# EasyEDA Pro project ProPrj_初级项目_2026-01-11.epro, schematic Schematic1_1
Board Name: Board1_1; Create Date: 2025-11-14; Page Name: P1; Project Name: 初级项目; Schematic Name: Schematic1_1; Update Date: 2025-12-01; Company: 嘉立创EDA; Page Size: A4; Version: V1.0
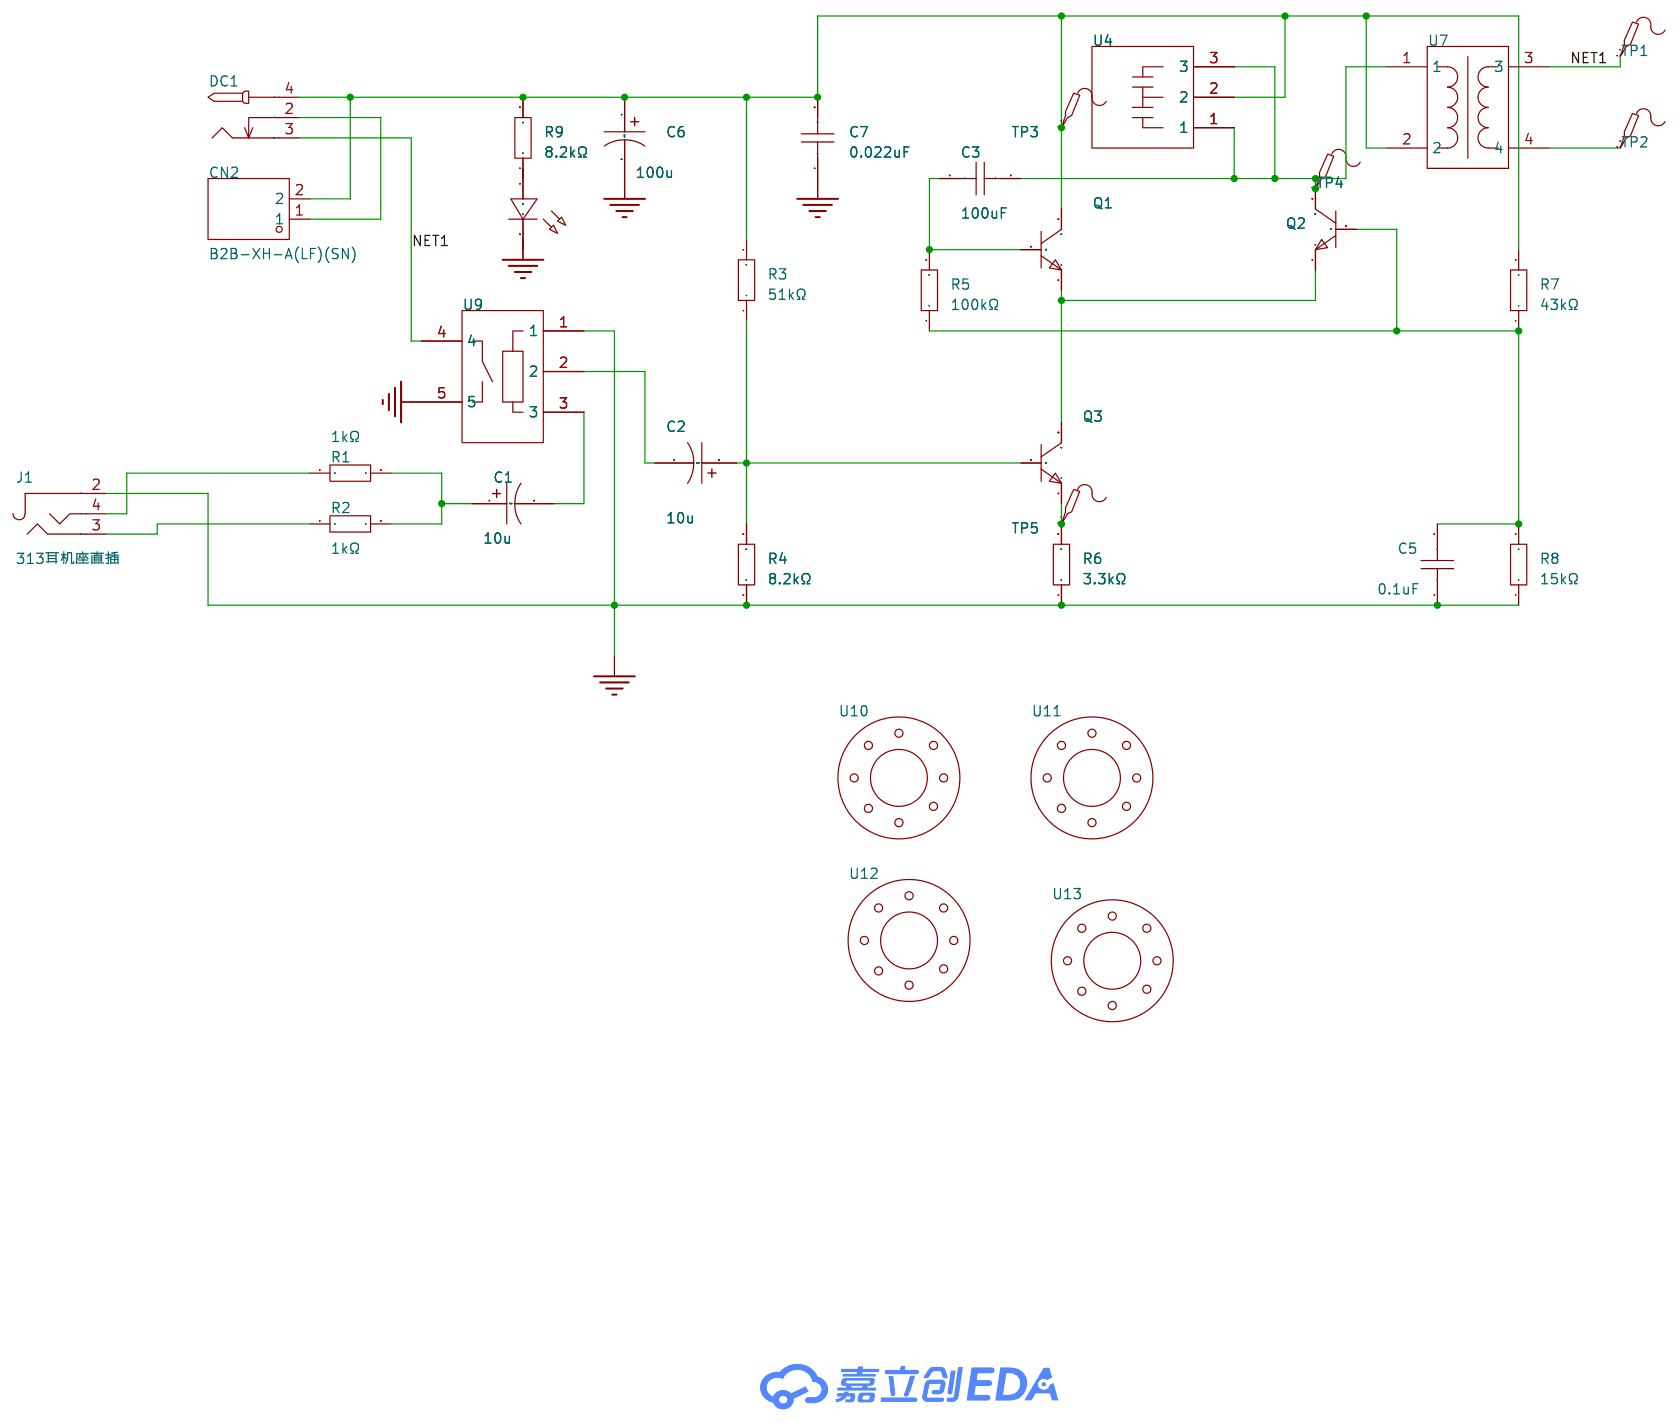
[diagram p2: schematic sheet]

## Parts
C1  10u  [CAP-TH_BD10.0-P5.00-D0.6-FD]
C2  10u  [CAP-TH_BD10.0-P5.00-D0.6-FD]
C3  100uF  [CAP-TH_L5.5-W3.8-P5.08-D0.5]
C5  0.1uF  [CAP-TH_L5.5-W3.8-P5.08-D0.5]
C6  100u  [CAP-TH_BD10.0-P5.00-D0.6-FD]
C7  0.022uF  [CAP-TH_L5.5-W3.8-P5.08-D0.5]
CN2  B2B-XH-A(LF)(SN)  [CONN-TH_B2B-XH-A-LF-SN]
DC1  -  [DC-2.0]
J1  313耳机座直插  [AUDIO-TH_PJ313D]
LED2  -  [LED-TH_5mm]
Q1  S9018H331  [TO-92-3_L4.8-W3.7-P1.27-L-1]
Q2  S9018H331  [TO-92-3_L4.8-W3.7-P1.27-L-1]
Q3  S9018H331  [TO-92-3_L4.8-W3.7-P1.27-L-1]
R1  1kΩ  [Res_1/8W]
R2  1kΩ  [Res_1/8W]
R3  51kΩ  [Res_1/8W]
R4  8.2kΩ  [Res_1/8W]
R5  100kΩ  [Res_1/8W]
R6  3.3kΩ  [Res_1/8W]
R7  43kΩ  [Res_1/8W]
R8  15kΩ  [Res_1/8W]
R9  8.2kΩ  [Res_1/8W]
TP1  -  [Test-Point-0.5mm]
TP2  -  [Test-Point-0.5mm]
TP3  -  [Test-Point-0.5mm]
TP4  -  [Test-Point-0.5mm]
TP5  -  [Test-Point-0.5mm]
U4  -  [可变电容]
U7  -  [天线变压器]
U9  -  [发射机点位图]
U10  -  [固定孔]
U11  -  [固定孔]
U12  -  [固定孔]
U13  -  [固定孔]

## Library data of the parts
C1 C2 C6 = LF221M1HBKJ1013VGN: Supplier Part: C9900022454; Supplier Footprint: 直插电解电容（高频）,220uF±20%,50V,Pitch=5mm,φ10mm,H13mm,剪脚，脚长3.6mm，佳维诚; JLCPCB Part Class: 扩展库; Supplier: LCSC
C3 C5 C7 = CT4-1206B225K250PF3: 容值:2.2uF;精度:±10%;额定电压:25V;温度系数:X7R;; LCSC Part Name: 2.2uF ±10% 25V; Supplier Part: C723346; Manufacturer: FH(风华); Supplier Footprint: 插件,P=5.08mm; JLCPCB Part Class: 扩展库; Datasheet: https://item.szlcsc.com/datasheet/CT4-1206B225K250PF3/768037.html; Supplier: LCSC; Tolerance: ±10%; Voltage Rating: 25V; Temperature Coefficient: X7R; Pin Spacing: 5.08mm
CN2 = B2B-XH-A(LF)(SN): 插针结构:1x2P;间距:2.5mm;安装方式:直插;参考系列:XH;总PIN数:2P;排数:1;每排PIN数:2;行距:-;额定电流:3A;触头材质:黄铜;触头镀层:锡;工作温度:-25℃~+85℃;; LCSC Part Name: 1x2P 间距:2.5mm 直插 系列:XH; Supplier Part: C158012; Manufacturer: JST; Supplier Footprint: 插件,P=2.5mm; JLCPCB Part Class: 扩展库; Datasheet: https://item.szlcsc.com/datasheet/B2B-XH-A(LF)(SN)/169360.html; Supplier: LCSC; Pins Structure: 1x2P; Pitch: 2.5mm; Mounting Type: 直插; Reference Series: XH; Number of Pins: 2P; Number of Rows: 1; Number of PINs Per Row: 2; Current Rating: 3A; Contact Material: 黄铜; Contact Plating: 锡; Operating Temperature: -25℃~+85℃; Voltage Rating: 250V; Plastic Material: PA66; Flame Retardant Rating: UL94V-0; Supplementary Features: 打K脚; Color: 白色; Z-Height of the Board: 7mm; X-Length of Bottom Edge on Board (Spacing Line): 7.4mm; Y-Width of Bottom Edge on Board: 5.75mm
DC1 = DC-005_2.0: Supplier Footprint: 插件
J1 = 313耳机座直插: 连接器类型:3.5mm耳机座;额定电流:500mA;额定电压:30V;; LCSC Part Name: 3.5mm耳机座; Supplier Part: C18167; Manufacturer: BOOMELE(博穆精密); Supplier Footprint: 插件; JLCPCB Part Class: 扩展库; Datasheet: https://item.szlcsc.com/datasheet/313%25E8%2580%25B3%25E6%259C%25BA%25E5%25BA%25A7%25E7%259B%25B4%25E6%258F%2592/18860.html; Supplier: LCSC; Connector Type: 3.5mm耳机座; Current Rating: 500mA; Voltage Rating (Max): 30V
LED2 = LED_TH-R_5mm: Supplier Footprint: 插件
Q1-Q3 = S9018H331: LCSC Part Name: 三极管(BJT); Supplier Part: C22751464; Manufacturer: ALJ(龙晶微); Supplier Footprint: TO-92; JLCPCB Part Class: 扩展库; Datasheet: https://atta.szlcsc.com/upload/public/pdf/source/20240627/B85A3921DB131425A2B38B393998D6F8.pdf; Supplier: LCSC
R1-R9 = Res_AXIAL-1/8W: Supplier Footprint: 轴向引线
TP1 TP2 = Test-Point: Test Point 测试点
TP3-TP5 = Test-Point
U4 = 可变电容
U7 = 天线变压器
U9 = 发射机电位器
U10-U13 = 固定孔

## Nets
GND: C5.1 C6.2 C7.1 J1.2 LED2.2(A) R4.1 R6.1 R8.1 U9.1 U9.5
NET1: DC1.3 TP1.1 U7.3 U9.4
$1N941: LED2.1(C) R9.1
$1N943: C3.1 Q1.2(B) R5.2
$1N944: C5.2 Q2.2(B) R5.1 R7.1 R8.2
$1N945: Q1.1(E) Q2.1(E) Q3.3(C)
$1N946: C2.1 Q3.2(B) R3.1 R4.2
$1N950: C1.1 R1.2 R2.2
$1N953: J1.3 R2.1
$1N954: J1.4 R1.1
$1N959: Q3.1(E) R6.2 TP5.1
$1N961: TP2.1 U7.4
$1N1572: C2.2 U9.2
$1N1624: C1.2 U9.3
$1N2623: C6.1 C7.2 CN2.2 DC1.4 Q1.3(C) R3.2 R7.2 R9.2 TP3.1 U4.2 U7.2
$1N2678: C3.2 Q2.3(C) TP4.1 U4.1 U4.3 U7.1
$1N2856: CN2.1 DC1.2
